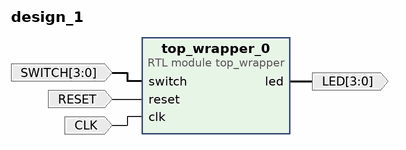
[diagram p0: block diagram of the top level]
# Vivado block design design_1, xc7z020clg400-1, Vivado 2020.1
create_bd_design design_1

create_bd_port -dir I -type clk CLK
set_property -dict {CONFIG.FREQ_HZ 100000000} [get_bd_ports CLK]
create_bd_port -dir I -type rst RESET
set_property -dict {CONFIG.POLARITY ACTIVE_HIGH} [get_bd_ports RESET]
create_bd_port -dir I -from 3 -to 0 SWITCH
create_bd_port -dir O -from 3 -to 0 LED

create_bd_cell -type module -reference top_wrapper top_wrapper_0

# ---- connections ----

connect_bd_net [get_bd_ports SWITCH] [get_bd_pins top_wrapper_0/switch]
connect_bd_net [get_bd_pins top_wrapper_0/led] [get_bd_ports LED]
connect_bd_net [get_bd_ports RESET] [get_bd_pins top_wrapper_0/reset]
connect_bd_net [get_bd_ports CLK] [get_bd_pins top_wrapper_0/clk]

validate_bd_design
save_bd_design
